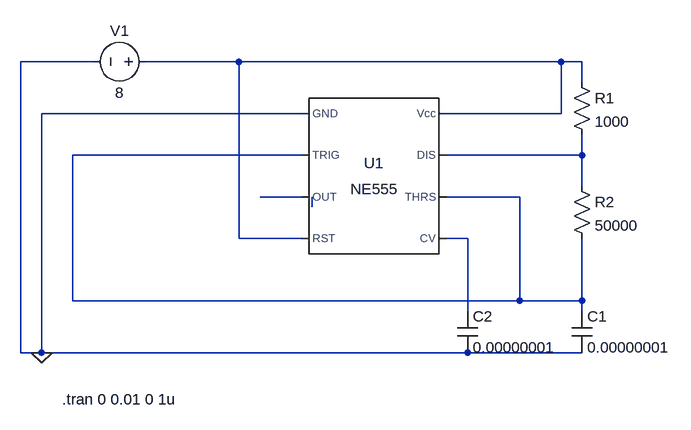
[diagram p0: schematic Draft2.asc]
Draft2.asc, the LTspice schematic file:
Version 4
SHEET 1 880 680
WIRE -528 -624 -640 -624
WIRE -304 -624 -448 -624
WIRE 192 -624 -304 -624
WIRE 224 -624 192 -624
WIRE 224 -592 224 -624
WIRE -208 -544 -608 -544
WIRE 192 -544 192 -624
WIRE 192 -544 16 -544
WIRE -208 -480 -560 -480
WIRE 224 -480 224 -512
WIRE 224 -480 16 -480
WIRE 224 -432 224 -480
WIRE -208 -416 -272 -416
WIRE 128 -416 16 -416
WIRE -192 -400 -192 -416
WIRE -304 -352 -304 -624
WIRE -208 -352 -304 -352
WIRE 48 -352 16 -352
WIRE -560 -256 -560 -480
WIRE 128 -256 128 -416
WIRE 128 -256 -560 -256
WIRE 224 -256 224 -352
WIRE 224 -256 128 -256
WIRE 48 -240 48 -352
WIRE 224 -240 224 -256
WIRE -640 -176 -640 -624
WIRE -608 -176 -608 -544
WIRE -608 -176 -640 -176
WIRE 48 -176 -608 -176
WIRE 224 -176 48 -176
FLAG -608 -176 0
SYMBOL Misc\\NE555 -96 -448 R0
SYMATTR InstName U1
SYMBOL res 208 -608 R0
SYMATTR InstName R1
SYMATTR Value 1000
SYMBOL res 208 -448 R0
SYMATTR InstName R2
SYMATTR Value 50000
SYMBOL cap 208 -240 R0
SYMATTR InstName C1
SYMATTR Value 0.00000001
SYMBOL cap 32 -240 R0
SYMATTR InstName C2
SYMATTR Value 0.00000001
SYMBOL voltage -432 -624 R90
WINDOW 0 -32 56 VBottom 2
WINDOW 3 32 56 VTop 2
WINDOW 123 0 0 Left 0
WINDOW 39 0 0 Left 0
SYMATTR InstName V1
SYMATTR Value 8
TEXT -576 -104 Left 2 !.tran 0 0.01 0 1u

The netlist it stands for:
* Draft2.asc
XU1 0 N002 N004 N001 N006 N002 N003 N001 NE555  ; pins GND TRIG OUT RST CV THRS DIS Vcc
R1 N001 N003 1000
R2 N003 N002 50000
C1 N002 0 0.00000001
C2 N006 0 0.00000001
V1 N001 0 8
.tran 0 0.01 0 1u
.lib NE555.sub
.backanno
.end